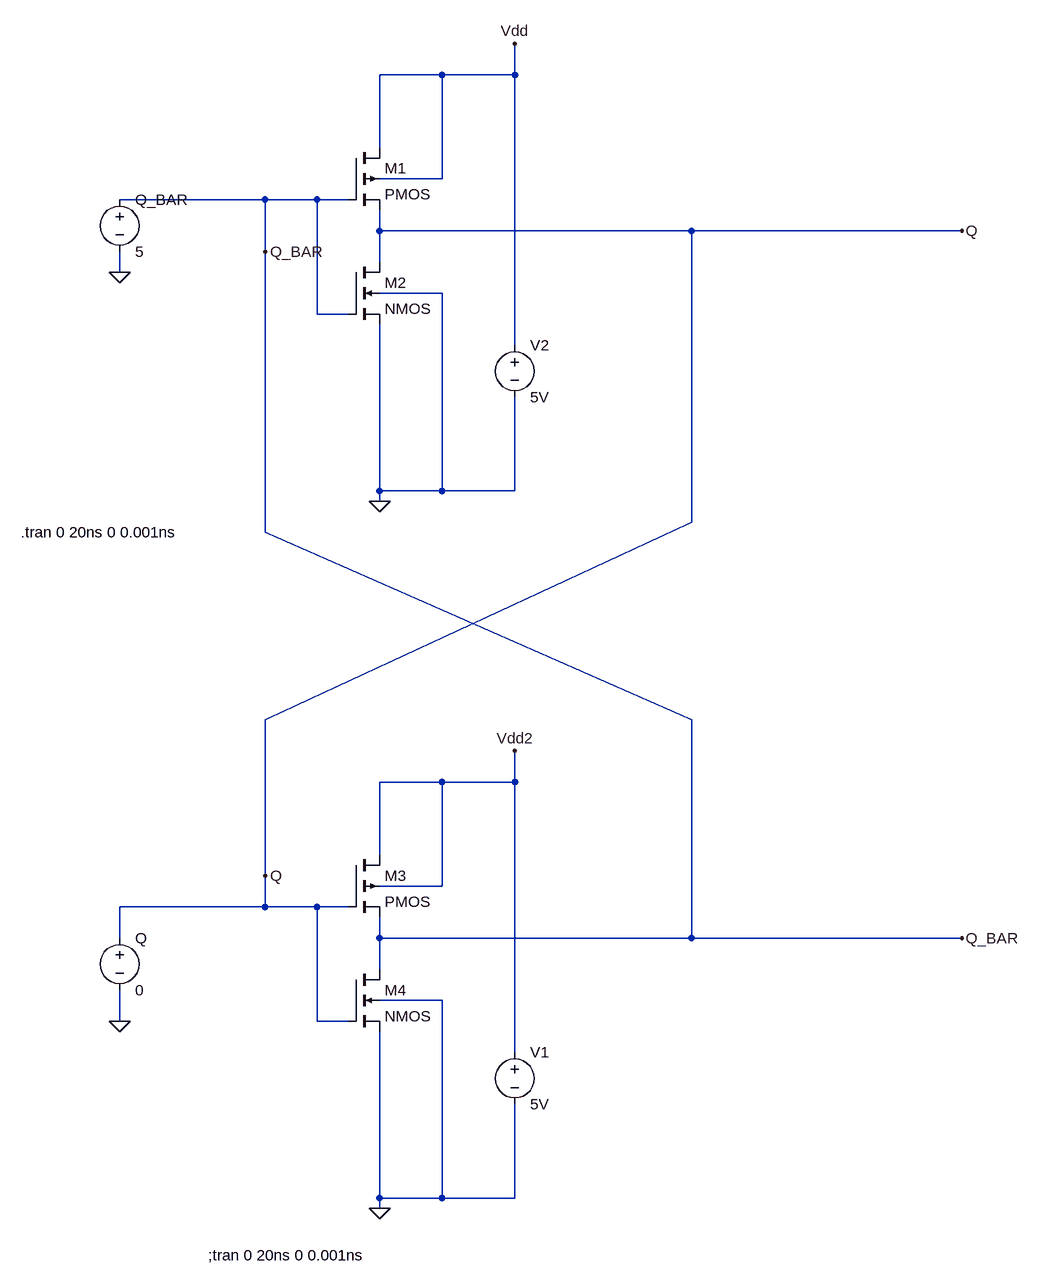
[diagram p0: schematic Cross-coupled-inverters.asc]
Cross-coupled-inverters.asc, the LTspice schematic file:
Version 4
SHEET 1 1204 1592
WIRE 304 -240 208 -240
WIRE 416 -240 416 -288
WIRE 416 -240 304 -240
WIRE 208 -128 208 -240
WIRE 304 -80 304 -240
WIRE 304 -80 208 -80
WIRE 32 -48 -192 -48
WIRE 112 -48 32 -48
WIRE 160 -48 112 -48
WIRE 208 0 208 -32
WIRE 688 0 208 0
WIRE 1104 0 688 0
WIRE 32 32 32 -48
WIRE 208 48 208 0
WIRE -192 64 -192 32
WIRE 304 96 208 96
WIRE 112 128 112 -48
WIRE 160 128 112 128
WIRE 416 176 416 -240
WIRE 208 400 208 144
WIRE 304 400 304 96
WIRE 304 400 208 400
WIRE 416 400 416 256
WIRE 416 400 304 400
WIRE 208 416 208 400
WIRE 688 448 688 0
WIRE 32 464 32 32
WIRE 32 752 688 448
WIRE 688 752 32 464
WIRE 304 848 208 848
WIRE 416 848 416 800
WIRE 416 848 304 848
WIRE 208 960 208 848
WIRE 32 992 32 752
WIRE 304 1008 304 848
WIRE 304 1008 208 1008
WIRE 32 1040 32 992
WIRE 32 1040 -192 1040
WIRE 112 1040 32 1040
WIRE 160 1040 112 1040
WIRE -192 1088 -192 1040
WIRE 208 1088 208 1056
WIRE 688 1088 688 752
WIRE 688 1088 208 1088
WIRE 1104 1088 688 1088
WIRE 208 1136 208 1088
WIRE 304 1184 208 1184
WIRE -192 1216 -192 1168
WIRE 112 1216 112 1040
WIRE 160 1216 112 1216
WIRE 416 1264 416 848
WIRE 208 1488 208 1232
WIRE 304 1488 304 1184
WIRE 304 1488 208 1488
WIRE 416 1488 416 1344
WIRE 416 1488 304 1488
WIRE 208 1504 208 1488
FLAG 208 416 0
FLAG 416 -288 Vdd
FLAG 208 1504 0
FLAG 32 992 Q
FLAG 416 800 Vdd2
FLAG 1104 0 Q
FLAG 1104 1088 Q_BAR
FLAG 32 32 Q_BAR
FLAG -192 64 0
FLAG -192 1216 0
SYMBOL voltage 416 160 R0
WINDOW 123 0 0 Left 0
WINDOW 39 0 0 Left 0
SYMATTR InstName V2
SYMATTR Value 5V
SYMBOL pmos4 160 -128 R0
SYMATTR InstName M1
SYMATTR Value2 l=0.6u w=6u
SYMBOL nmos4 160 48 R0
SYMATTR InstName M2
SYMATTR Value2 l=0.6u w=3u
SYMBOL voltage 416 1248 R0
WINDOW 123 0 0 Left 0
WINDOW 39 0 0 Left 0
SYMATTR InstName V1
SYMATTR Value 5V
SYMBOL pmos4 160 960 R0
SYMATTR InstName M3
SYMATTR Value2 l=0.6u w=6u
SYMBOL nmos4 160 1136 R0
SYMATTR InstName M4
SYMATTR Value2 l=0.6u w=3u
SYMBOL voltage -192 -64 R0
WINDOW 123 0 0 Left 0
WINDOW 39 0 0 Left 0
SYMATTR InstName Q_BAR
SYMATTR Value 5
SYMBOL voltage -192 1072 R0
WINDOW 123 0 0 Left 0
WINDOW 39 0 0 Left 0
SYMATTR InstName Q
SYMATTR Value 0
TEXT -344 464 Left 2 !.tran 0 20ns 0 0.001ns
TEXT -56 1576 Left 2 !;tran 0 20ns 0 0.001ns

The netlist it stands for:
* Cross-coupled-inverters.asc
V2 Vdd 0 5V
M1 Vdd Q_BAR Q Vdd PMOS l=0.6u w=6u
M2 Q Q_BAR 0 0 NMOS l=0.6u w=3u
V1 Vdd2 0 5V
M3 Vdd2 Q Q_BAR Vdd2 PMOS l=0.6u w=6u
M4 Q_BAR Q 0 0 NMOS l=0.6u w=3u
V§Q_BAR Q_BAR 0 5
V§Q Q 0 0
.model NMOS NMOS
.model PMOS PMOS
.lib standard.mos
.tran 0 20ns 0 0.001ns
;tran 0 20ns 0 0.001ns
.backanno
.end